# Altium schematic sheet ts-50s-digi-interface-schematic.SchDoc: Kenwood TS50s Digital Interface
size A4; Organization: 4S6TMP; Address1: Sri Lanka; DocumentNumber: 1; Revision: 1.0; SheetNumber: 1; SheetTotal: 1
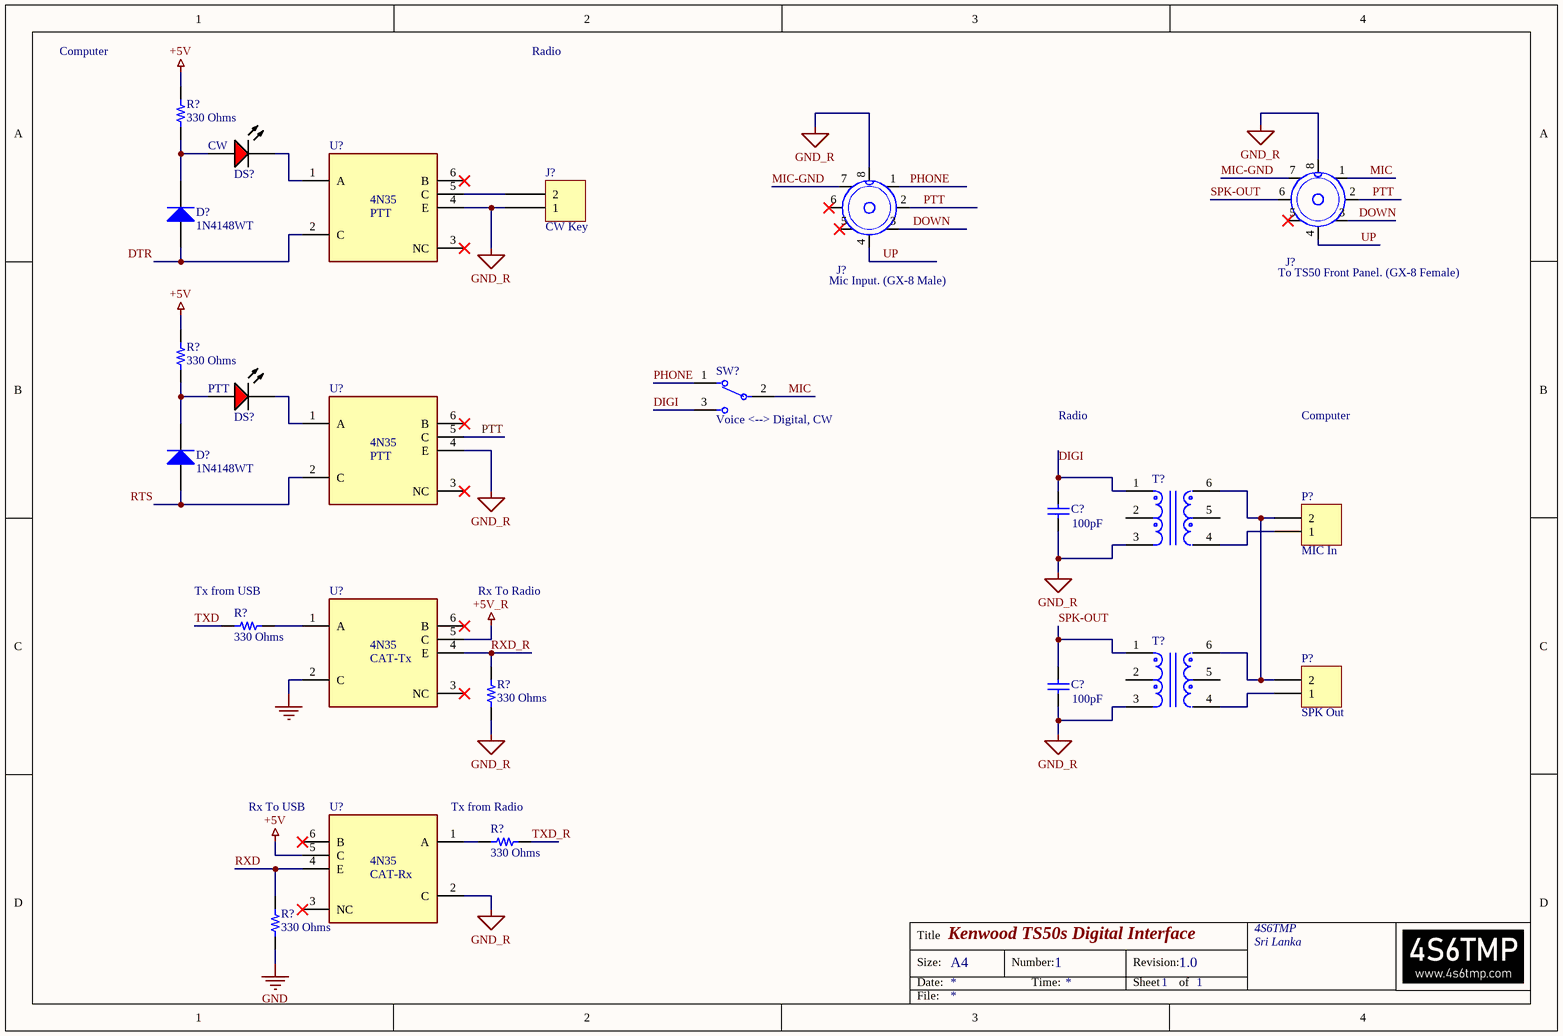
[diagram p0: ts-50s-digi-interface-schematic.SchDoc]

## Parts
(Parts that share a designator on the sheet are numbered #1, #2 ... from top to bottom, then left to right.)
C?#1  value 100pF  [RAD-0.3]  (hidden comment: Cap)
C?#2  value 100pF  [RAD-0.3]  (hidden comment: Cap)
D?#1  1N4148WT  [FAIR-SOD-523F-2_V]
D?#2  1N4148WT  [FAIR-SOD-523F-2_V]
DS?#1  CW  [AVAG-HLMP-3301-2]
DS?#2  PTT  [AVAG-HLMP-3301-2]
J?#1  To TS50 Front Panel. (GX-8 Female)  [GX-8]
J?#2  CW Key  [MOLEX KK 0022272021]
J?#3  Mic Input. (GX-8 Male)  [GX-8]
P?#1  MIC In  [HDR1X2]
P?#2  SPK Out  [HDR1X2]
R?#1  330 Ohms  [RES 0603_1608]
R?#2  330 Ohms  [RES 0603_1608]
R?#3  330 Ohms  [RES 0603_1608]
R?#4  330 Ohms  [RES 0603_1608]
R?#5  330 Ohms  [RES 0603_1608]
R?#6  330 Ohms  [RES 0603_1608]
SW?  Voice <--> Digital, CW  [FP-A101SDCQ04-MFG]
T?#1  SM-LP-5001  [SM-LP-5001]  (value not drawn)
T?#2  SM-LP-5001  [SM-LP-5001]  (value not drawn)
U?#1  PTT  Part Number: 4N35  [Vishay_4N35_0]
U?#2  PTT  Part Number: 4N35  [Vishay_4N35_0]
U?#3  CAT-Tx  Part Number: 4N35  [Vishay_4N35_0]
U?#4  CAT-Rx  Part Number: 4N35  [Vishay_4N35_0]

## Nets
+5V: R?#1.2 R?#2.2 U?#4.5(C)
+5V_R: U?#3.5(C)
GND: R?#6.2 U?#3.2(C)
GND_R: C?#1.1 C?#2.1 J?#1.8 J?#2.1 J?#3.8 R?#4.2 T?#1.3 T?#2.3 U?#1.4(E) U?#2.4(E) U?#4.2(C)
DIGI: C?#1.2 SW?.3 T?#1.1
DOWN: J?#1.3 J?#3.3
DTR: D?#1.2(A) U?#1.2(C)
MIC: J?#1.1 SW?.2
MIC-GND: J?#1.7 J?#3.7
PHONE: J?#3.1 SW?.1
PTT: J?#1.2 J?#3.2 U?#2.5(C)
RTS: D?#2.2(A) U?#2.2(C)
RXD: R?#6.1 U?#4.4(E)
RXD_R: R?#4.1 U?#3.4(E)
SPK-OUT: C?#2.2 J?#1.6 T?#2.1
TXD: R?#3.2
TXD_R: R?#5.1
UP: J?#1.4 J?#3.4
NetD?#1_1: D?#1.1(K) DS?#1.2(A) R?#1.1
NetD?#2_1: D?#2.1(K) DS?#2.2(A) R?#2.1
NetDS?#1_1: DS?#1.1(K) U?#1.1(A)
NetDS?#2_1: DS?#2.1(K) U?#2.1(A)
NetJ?#2_2: J?#2.2 U?#1.5(C)
NetP?#1_1: P?#1.1 T?#1.4
NetP?#1_2: P?#1.2 P?#2.2 T?#1.6 T?#2.6
NetP?#2_1: P?#2.1 T?#2.4
NetR?#3_1: R?#3.1 U?#3.1(A)
NetR?#5_2: R?#5.2 U?#4.1(A)

Not connected (* = marked no-connect by the designer): J?#1 5*; J?#3 5* 6*; T?#1 2 5; T?#2 2 5; U?#1 3(NC)* 6(B)*; U?#2 3(NC)* 6(B)*; U?#3 3(NC)* 6(B)*; U?#4 3(NC)* 6(B)*

## Notes on the sheet
- Computer
- Radio
- (near R?#3) Tx from USB
- (near U?#3) Rx To Radio
- (near U?#4) Rx To USB
- Tx from Radio
- Title
- Size:
- Date:
- A4
- Number:
- Time:
- Revision:
- Sheet
- of
- File:

## Library data of the parts
C?#1 C?#2 = Cap: Capacitor; Published: 8-Jun-2000; LatestRevisionDate: 17-Jul-2002; LatestRevisionNote: Re-released for DXP Platform.; PackageReference: RAD-0.3; Publisher: Altium Limited; PackageDescription: Radial Cap, Thru-Hole; 2 Leads; 0.3 in Pin Spacing
D?#1 D?#2 = CMP-0881-00001-1: High Conductance Fast Switching Diode, 75 V, -55 to 150 degC, 2-Pin SOD523F, RoHS; Manufacturer: Fairchild Semiconductor; IR (VR: 75 V)=5 uA Max.; VF: 1 V Max.; BVR (IR: 5 uA)=75 V Min.; CO: 4 pF Max.; DatasheetVersion: Rev. A2; ComponentLink1Description: Manufacturer URL; PackageDescription: 2-Pin Surface Mount Device, Body 1.2 x 0.8 mm, Height 0.7 mm; ComponentLink2URL: http://www.fairchildsemi.com/ds/1N/1N4148WT.pdf; ComponentLink2Description: Datasheet; PartNumber: 1N4148WT; ComponentLink1URL: http://www.fairchildsemi.com/; Temperature Range: -55 to 150 degC; Mounting Technology: Surface Mount; PackageReference: SOD-523F-2; RoHS: TRUE
DS?#1 DS?#2 = CMP-2000-06411-1: T-1 3/4 (5 mm) Diffused LED Lamp, 1.9 V, -40 to 100 degC, 2-Pin THD, RoHS, Bulk; Manufacturer: Avago; Forward Current: 25mA; Forward Voltage: 2.4V; Peak Wavelength: 635nm; Shape Type: Circular; High Brightness: No; Main Category: StandardLED; Test Current (It): 10mA; Dominant Wave Length: 626nm; Number of  Elements: 1; Reverse Voltage: 5V; Chip Material: GaP; Product Height (mm): 9.19mm; Lens Type: ColoredDiffused; Viewing Angle: 60deg; Type: Uni-Color; Emitting Color: Red; Luminous Intensity: 5.4mcd; Power Dissipation: 85W; DELETED: Compliant; Product Depth (mm): 6.1mm; Package Description: 2-Pin Through Hole LED, Dia 5.85 mm; Mounting Technology: ThroughHole; Manufacturer URL: http://www.avagotech.com/; Package Type: T-13/4; Operating Temp Range: -40Cto100C; Datasheet URL: http://www.avagotech.com/docs/AV02-1558EN; Mounting: ThroughHole; Lens Dimensions: 5.08x5.08x8.3mm; Package Reference: HLMP-3301; Datasheet Version: 03/2015; Pin Count: 2; Packaging: TapeandReel; Operating Temperature Classification: Industrial; Lum Intensity: 5.4mcd; Rad Hardened: No; Product Length (mm): 6.1mm
J?#1 J?#3 = GX-8: 8 Position Circular Connector Receptacle, Male Pins Solder; Manufacturer: Amphenol Tuchel Industrial; Manufacturer Product Number: C09131W0081002U; ComponentLink1Description: Manufacturer Link; ComponentLink1URL: https://www.digikey.com/en/products/detail/amphenol-tuchel-industrial/C09131W0081002U/1036183; ComponentLink2Description: Datasheet; ComponentLink2URL: http://www.amphenol-sine.com/pdf/catalog/C091.pdf
J?#2 = 0022272021: CONN HEADER VERT 2POS 2.54MM; Manufacturer: Molex; Contact Length - Mating: 0.295" (7.49mm); Contact Length - Post: 0.140" (3.56mm); Material Flammability Rating: UL94 V-0; Number of Positions: 2; Number of Positions Loaded: All; Overall Contact Length: 0.560" (14.22mm); Pitch - Mating: 0.100" (2.54mm); Shrouding: Shrouded - 1 Wall; Style: Board to Cable/Wire; Part Number: 0022272021; ComponentLink1Description: Datasheet; ComponentLink1URL: https://www.molex.com/pdm_docs/sd/022272021_sd.pdf; ComponentLink2Description: DigiKey Link; ComponentLink2URL: http://digikey.com/product-detail/en/molex/0022272021/WM4111-ND/1130577; Connector Type: Header; Contact Finish - Mating: Tin; Contact Finish - Post: Tin; Contact Finish Thickness - Mating: 100.0µin (2.54µm); Contact Material: Brass; Contact Shape: Square; Contact Type: Male Pin; Fastening Type: Friction Lock; Insulation Color: Natural; Insulation Height: 0.461" (11.70mm); Insulation Material: Polyamide (PA), Nylon; LastUpdated: 12/01/2020 23:51:43; Lifecycle Status: Active; Minimum Order: 1; Mounting Type: Through Hole; Number of Rows: 1; Packaging: Bulk; PartId: 76; Part Status: Active; Price: 0.27; Series: KK 6410; Supplier 1: DigiKey; Supplier Part Number 1: WM4111-ND; Termination: Solder
P?#1 P?#2 = Header 2: 3.5mm Mono; LatestRevisionDate: 17-Jul-2002; LatestRevisionNote: Re-released for DXP Platform.; Publisher: Altium Limited
R?#1-R?#6 = AC0603FR-07330RL: RES SMD 330 OHM 1% 1/10W 0603; Manufacturer: Yageo; Power (Watts): 0.1W, 1/10W; Temperature Coefficient: ±100ppm/°C; Part Number: AC0603FR-07330RL; Value: 330 Ohms; ComponentLink1Description: Datasheet; ComponentLink1URL: https://www.yageo.com/upload/media/product/productsearch/datasheet/rchip/PYu-AC_51_RoHS_L_7.pdf; ComponentLink2Description: DigiKey Link; ComponentLink2URL: http://digikey.com/product-detail/en/yageo/AC0603FR-07330RL/YAG3595CT-ND/6006444; Composition: Thick Film; Device Package: 0603 (1608 Metric); Features: Automotive AEC-Q200, Moisture Resistant; Height - Seated (Max): 0.022" (0.55mm); LastUpdated: 02/09/2020 01:09:46; Lifecycle Status: Active; Minimum Order: 1; Number of Terminations: 2; Operating Temperature: -55°C ~ 155°C; Package / Case: 0603 (1608 Metric); Packaging: CutTape; PartId: 22572; Part Status: Active; Price: 0.10; Ratings: AEC-Q200; Resistance: 330 Ohms; Series: AC; Size / Dimension: 0.063" L x 0.031" W (1.60mm x 0.80mm); Supplier 1: DigiKey; Supplier Part Number 1: YAG3595CT-ND; Supplier Device Package: 0603; Tolerance: ±1%
SW? = CMP-03408-000002-1: SWITCH TOGGLE SPDT 5A 120V; Contact Resistance: 10mR; Actuator Length: 12.19mm; Actuator Material: Phenolic; Mount: PCB; Case/Package: 125; Contact Material: Copper; Termination: Through Hole; Contact Current Rating: 5A; Package Quantity: 100; Max Operating Temperature: 85°C; Series: Gemini A; Min Operating Temperature: -30°C; Throw Configuration: SPDT
T?#1 T?#2 = CMP-07264-000002-1: TRANSFORMER LINE MATCHING SMD
U?#1-U?#4 = IC_Vishay_4N35_eec: IC OPTOISO 5KV TRANS W/BASE 6DIP; Manufacturer: Vishay; helpURL: https://upverter.com/upn/revision/7474c0fadec3a473/; ComponentLink2Description: Datasheet; Temperature: -55°C to +100°C; Package: 4N35; Supplier 2: Mouser; Price: 0.32203113639; Supplier 1: Digi-Key; ComponentLink1URL: https://upverter.com/upn/revision/7474c0fadec3a473/; Supplier Part Number 2: 78-4N35; Supplier Part Number 1: 4N35-ND; ComponentLink1Description: Upverter; ComponentLink2URL: https://www.vishay.com/docs/81181/4n35.pdf; RoHS: TRUE; Mouser Part Number: 78-4N35; Ipc Land Pattern Name: DIP762W50P254L712H450Q6; Temperature Range High: +100°C; Digikey Description: IC OPTOISO 5KV TRANS W/BASE 6DIP; Digikey Part Number: 4N35-ND; Lead Free: yes; Mfg Package Ident: 4N35; Temperature Range Low: -55°C